# Altium schematic sheet HANC_Digital_TS.SchDoc
size B
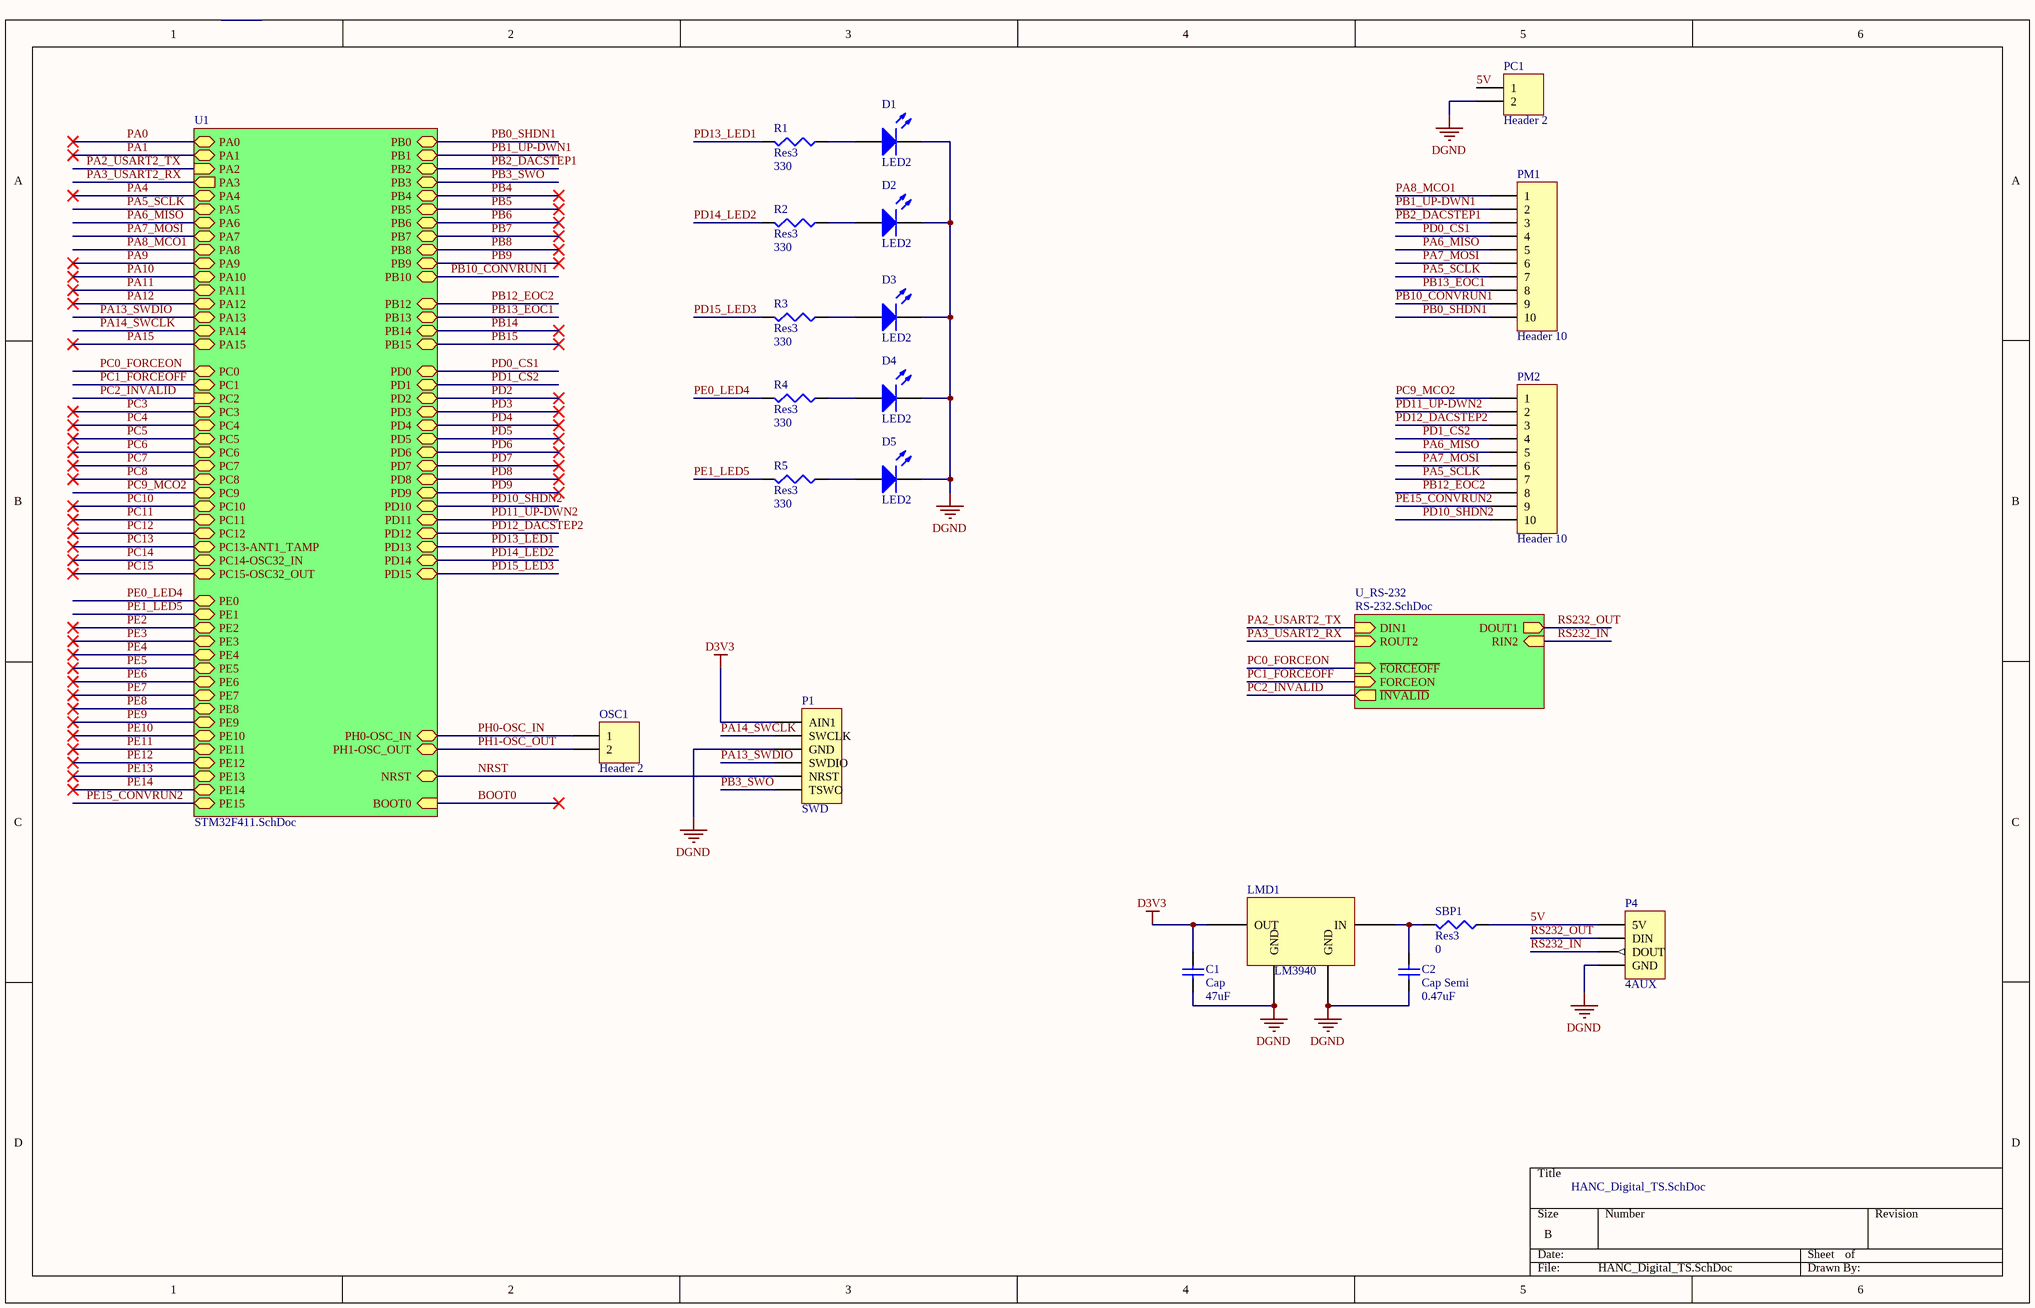
[diagram p0: HANC_Digital_TS.SchDoc]

## Parts
C1  Cap  value 47uF  [1608[0603]]
C2  Cap Semi  value 0.47uF  [1608[0603]]
D1  LED2  [3.2X1.6X1.1]
D2  LED2  [3.2X1.6X1.1]
D3  LED2  [3.2X1.6X1.1]
D4  LED2  [3.2X1.6X1.1]
D5  LED2  [3.2X1.6X1.1]
LMD1  LM3940  [SOT223_N]
OSC1  Header 2  [HDR1X2]
P1  SWD  [HDR1X6]
P4  4AUX  [HDR1X4]
PC1  Header 2  [HDR1X2]
PM1  Header 10  [HDR1X10]
PM2  Header 10  [HDR1X10]
R1  Res3  value 330  [0402]
R2  Res3  value 330  [0402]
R3  Res3  value 330  [0402]
R4  Res3  value 330  [0402]
R5  Res3  value 330  [0402]
SBP1  Res3  value 0  [J1-0603]

## Sub-sheets
U1 = STM32F411.SchDoc: PE2 (bidir), PH0-OSC_IN (bidir), PH1-OSC_OUT (bidir), NRST (bidir), PC0 (bidir), PC1 (bidir), PC2 (in), PC3 (bidir), PE3 (bidir), PA0 (bidir), PA1 (bidir), PA2 (in), PA3 (out), PA4 (bidir), PE4 (bidir), PA5 (bidir), PA6 (bidir), PA7 (bidir), PC4 (bidir), PC5 (bidir), PB0 (bidir), PB1 (bidir), PB2 (bidir), PE7 (bidir), PE8 (bidir), PE5 (bidir), PE9 (bidir), PE10 (bidir), PE11 (bidir), PE12 (bidir), PE13 (bidir), PE14 (bidir), PE15 (bidir), PB10 (bidir), PE6 (bidir), PB12 (bidir), PB13 (bidir), PB14 (bidir), PB15 (bidir), PD8 (bidir), PD9 (bidir), PD10 (bidir), PD11 (bidir), PD12 (bidir), PD13 (bidir), PD14 (bidir), PD15 (bidir), PC6 (bidir), PC7 (bidir), PC8 (bidir), PC9 (bidir), PA8 (bidir), PA9 (bidir), PA10 (bidir), PC13-ANT1_TAMP (bidir), PA11 (bidir), PA12 (bidir), PA13 (bidir), PA14 (bidir), PA15 (bidir), PC10 (bidir), PC11 (bidir), PC14-OSC32_IN (bidir), PC12 (bidir), PD0 (bidir), PD1 (bidir), PD2 (bidir), PD3 (bidir), PD4 (bidir), PD5 (bidir), PD6 (bidir), PD7 (bidir), PB3 (bidir), PC15-OSC32_OUT (bidir), PB4 (bidir), PB5 (bidir), PB6 (bidir), PB7 (bidir), BOOT0, PB8 (bidir), PB9 (bidir), PE0 (bidir), PE1 (bidir)
U_RS-232 = RS-232.SchDoc: DIN1 (in), RIN2 (in), ~{FORCEOFF} (in), FORCEON (in), DOUT1 (out), ROUT2 (in), ~{INVALID} (out)

## Nets
D3V3: C1.2 LMD1.3(OUT) P1.1(AIN1)
DGND: C1.1 C2.1 D1.2(K) D2.2(K) D3.2(K) D4.2(K) D5.2(K) LMD1.2(GND) LMD1.4(GND) P1.3(GND) P4.4(GND) PC1.2
5V: P4.1(5V) PC1.1 SBP1.1
BOOT0: sheet U1/BOOT0
NRST: P1.5(NRST) ; sheet U1/NRST
PA0: sheet U1/PA0
PA1: sheet U1/PA1
PA2_USART2_TX: sheet U1/PA2, sheet U_RS-232/DIN1
PA3_USART2_RX: sheet U1/PA3, sheet U_RS-232/ROUT2
PA4: sheet U1/PA4
PA5_SCLK: PM1.7 PM2.7 ; sheet U1/PA5
PA6_MISO: PM1.5 PM2.5 ; sheet U1/PA6
PA7_MOSI: PM1.6 PM2.6 ; sheet U1/PA7
PA8_MCO1: PM1.1 ; sheet U1/PA8
PA9: sheet U1/PA9
PA10: sheet U1/PA10
PA11: sheet U1/PA11
PA12: sheet U1/PA12
PA13_SWDIO: P1.4(SWDIO) ; sheet U1/PA13
PA14_SWCLK: P1.2(SWCLK) ; sheet U1/PA14
PA15: sheet U1/PA15
PB0_SHDN1: PM1.10 ; sheet U1/PB0
PB1_UP-DWN1: PM1.2 ; sheet U1/PB1
PB2_DACSTEP1: PM1.3 ; sheet U1/PB2
PB3_SWO: P1.6(TSWO) ; sheet U1/PB3
PB4: sheet U1/PB4
PB5: sheet U1/PB5
PB6: sheet U1/PB6
PB7: sheet U1/PB7
PB8: sheet U1/PB8
PB9: sheet U1/PB9
PB10_CONVRUN1: PM1.9 ; sheet U1/PB10
PB12_EOC2: PM2.8 ; sheet U1/PB12
PB13_EOC1: PM1.8 ; sheet U1/PB13
PB14: sheet U1/PB14
PB15: sheet U1/PB15
PC0_FORCEON: sheet U1/PC0, sheet U_RS-232/~{FORCEOFF}
PC1_FORCEOFF: sheet U1/PC1, sheet U_RS-232/FORCEON
PC2_INVALID: sheet U1/PC2, sheet U_RS-232/~{INVALID}
PC3: sheet U1/PC3
PC4: sheet U1/PC4
PC5: sheet U1/PC5
PC6: sheet U1/PC6
PC7: sheet U1/PC7
PC8: sheet U1/PC8
PC9_MCO2: PM2.1 ; sheet U1/PC9
PC10: sheet U1/PC10
PC11: sheet U1/PC11
PC12: sheet U1/PC12
PC13: sheet U1/PC13-ANT1_TAMP
PC14: sheet U1/PC14-OSC32_IN
PC15: sheet U1/PC15-OSC32_OUT
PD0_CS1: PM1.4 ; sheet U1/PD0
PD1_CS2: PM2.4 ; sheet U1/PD1
PD2: sheet U1/PD2
PD3: sheet U1/PD3
PD4: sheet U1/PD4
PD5: sheet U1/PD5
PD6: sheet U1/PD6
PD7: sheet U1/PD7
PD8: sheet U1/PD8
PD9: sheet U1/PD9
PD10_SHDN2: PM2.10 ; sheet U1/PD10
PD11_UP-DWN2: PM2.2 ; sheet U1/PD11
PD12_DACSTEP2: PM2.3 ; sheet U1/PD12
PD13_LED1: R1.2 ; sheet U1/PD13
PD14_LED2: R2.2 ; sheet U1/PD14
PD15_LED3: R3.2 ; sheet U1/PD15
PE0_LED4: R4.2 ; sheet U1/PE0
PE1_LED5: R5.2 ; sheet U1/PE1
PE2: sheet U1/PE2
PE3: sheet U1/PE3
PE4: sheet U1/PE4
PE5: sheet U1/PE5
PE6: sheet U1/PE6
PE7: sheet U1/PE7
PE8: sheet U1/PE8
PE9: sheet U1/PE9
PE10: sheet U1/PE10
PE11: sheet U1/PE11
PE12: sheet U1/PE12
PE13: sheet U1/PE13
PE14: sheet U1/PE14
PE15_CONVRUN2: PM2.9 ; sheet U1/PE15
PH0-OSC_IN: OSC1.1 ; sheet U1/PH0-OSC_IN
PH1-OSC_OUT: OSC1.2 ; sheet U1/PH1-OSC_OUT
RS232_IN: P4.3(DOUT) ; sheet U_RS-232/RIN2
RS232_OUT: P4.2(DIN) ; sheet U_RS-232/DOUT1
NetC2_2: C2.2 LMD1.1(IN) SBP1.2
NetD1_1: D1.1(A) R1.1
NetD2_1: D2.1(A) R2.1
NetD3_1: D3.1(A) R3.1
NetD4_1: D4.1(A) R4.1
NetD5_1: D5.1(A) R5.1

## Library data of the parts
C1 = Cap Semi: Capacitor (Semiconductor SIM Model); PartNumber: CL10A476MQENRBE; Published: 8-Jun-2000; LatestRevisionDate: 29-May-2009; LatestRevisionNote: IPC-7351 Footprint Added.; PackageReference: C1206; Publisher: Altium Limited; PackageDescription: Chip Capacitor
C2 = Cap Semi: Capacitor (Semiconductor SIM Model); PartNumber: GRM033R60J474KE90D; Published: 8-Jun-2000; LatestRevisionDate: 29-May-2009; LatestRevisionNote: IPC-7351 Footprint Added.; PackageReference: C1206; Publisher: Altium Limited; PackageDescription: Chip Capacitor
D1-D5 = LED2: Typical RED, GREEN, YELLOW, AMBER GaAs LED; PartNumber: LTST-C150CKT; Published: 8-Jun-2000; LatestRevisionDate: 17-Jul-2002; LatestRevisionNote: Re-released for DXP Platform.; PackageVersion: Feb-2002; PackageReference: 3.2X1.6X1.1; Publisher: Altium Limited; PackageDescription: SM LED; 2 Flat Leads
LMD1 = Component_1: PartNumber: LM3940IMP-3.3/NOPB; DatasheetVersion: http://www.ti.com/lit/ds/symlink/lm3940.pdf
OSC1 PC1 = Header 2: Header, 2-Pin; LatestRevisionDate: 17-Jul-2002; LatestRevisionNote: Re-released for DXP Platform.; Publisher: Altium Limited
P1 = Header 6: Header, 6-Pin; LatestRevisionDate: 17-Jul-2002; LatestRevisionNote: Re-released for DXP Platform.; Publisher: Altium Limited
P4 = Header 4: Header, 4-Pin; LatestRevisionDate: 17-Jul-2002; LatestRevisionNote: Re-released for DXP Platform.; Publisher: Altium Limited
PM1 PM2 = Header 10: Header, 10-Pin; LatestRevisionDate: 17-Jul-2002; LatestRevisionNote: Re-released for DXP Platform.; Publisher: Altium Limited
R1-R5 = Res3: Resistor; PartNumber: RC0402FR-07330RL; Published: 8-Jun-2000; LatestRevisionDate: 29-May-2009; LatestRevisionNote: IPC-7351 Footprint Added.; PackageReference: J1-0603; Publisher: Altium Limited; PackageDescription: Chip Resistor
SBP1 = Res3: Resistor; PartNumber: Keystone Electronics 5110; Published: 8-Jun-2000; LatestRevisionDate: 29-May-2009; LatestRevisionNote: IPC-7351 Footprint Added.; PackageReference: J1-0603; Publisher: Altium Limited; PackageDescription: Chip Resistor